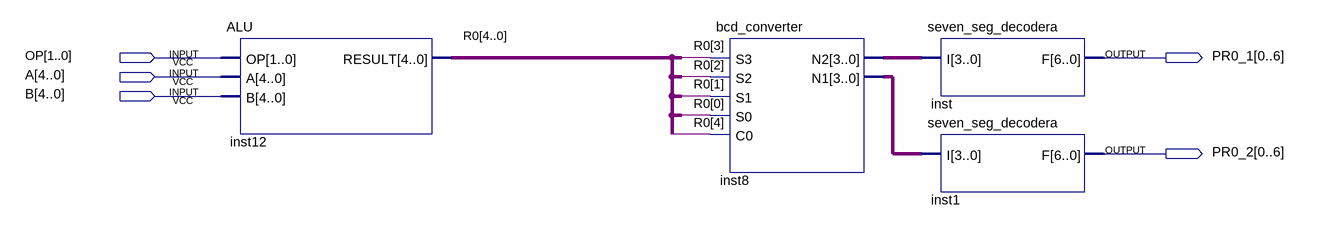
[diagram p0: schematic sheet]
// Quartus schematic ALU_COMPLETE.bdf as structural Verilog: 4 symbols, 5 pins
module ALU_COMPLETE (
  input  [1:0] OP,
  input  [4:0] A,
  input  [4:0] B,
  output [0:6] PR0_1,
  output [0:6] PR0_2
);

  wire [3:0] inst8_n1, inst8_n2;
  wire [4:0] R0;

  ALU inst12 (.OP(OP), .A(A), .B(B), .RESULT(R0));
  bcd_converter inst8 (.S3(R0[3]), .S2(R0[2]), .S1(R0[1]), .S0(R0[0]), .C0(R0[4]), .N2(inst8_n2), .N1(inst8_n1));
  seven_seg_decodera inst (.I(inst8_n2), .F(PR0_1));
  seven_seg_decodera inst1 (.I(inst8_n1), .F(PR0_2));
endmodule
